# EAGLE design LACE_mod_con_auto (EAGLE 5.07)
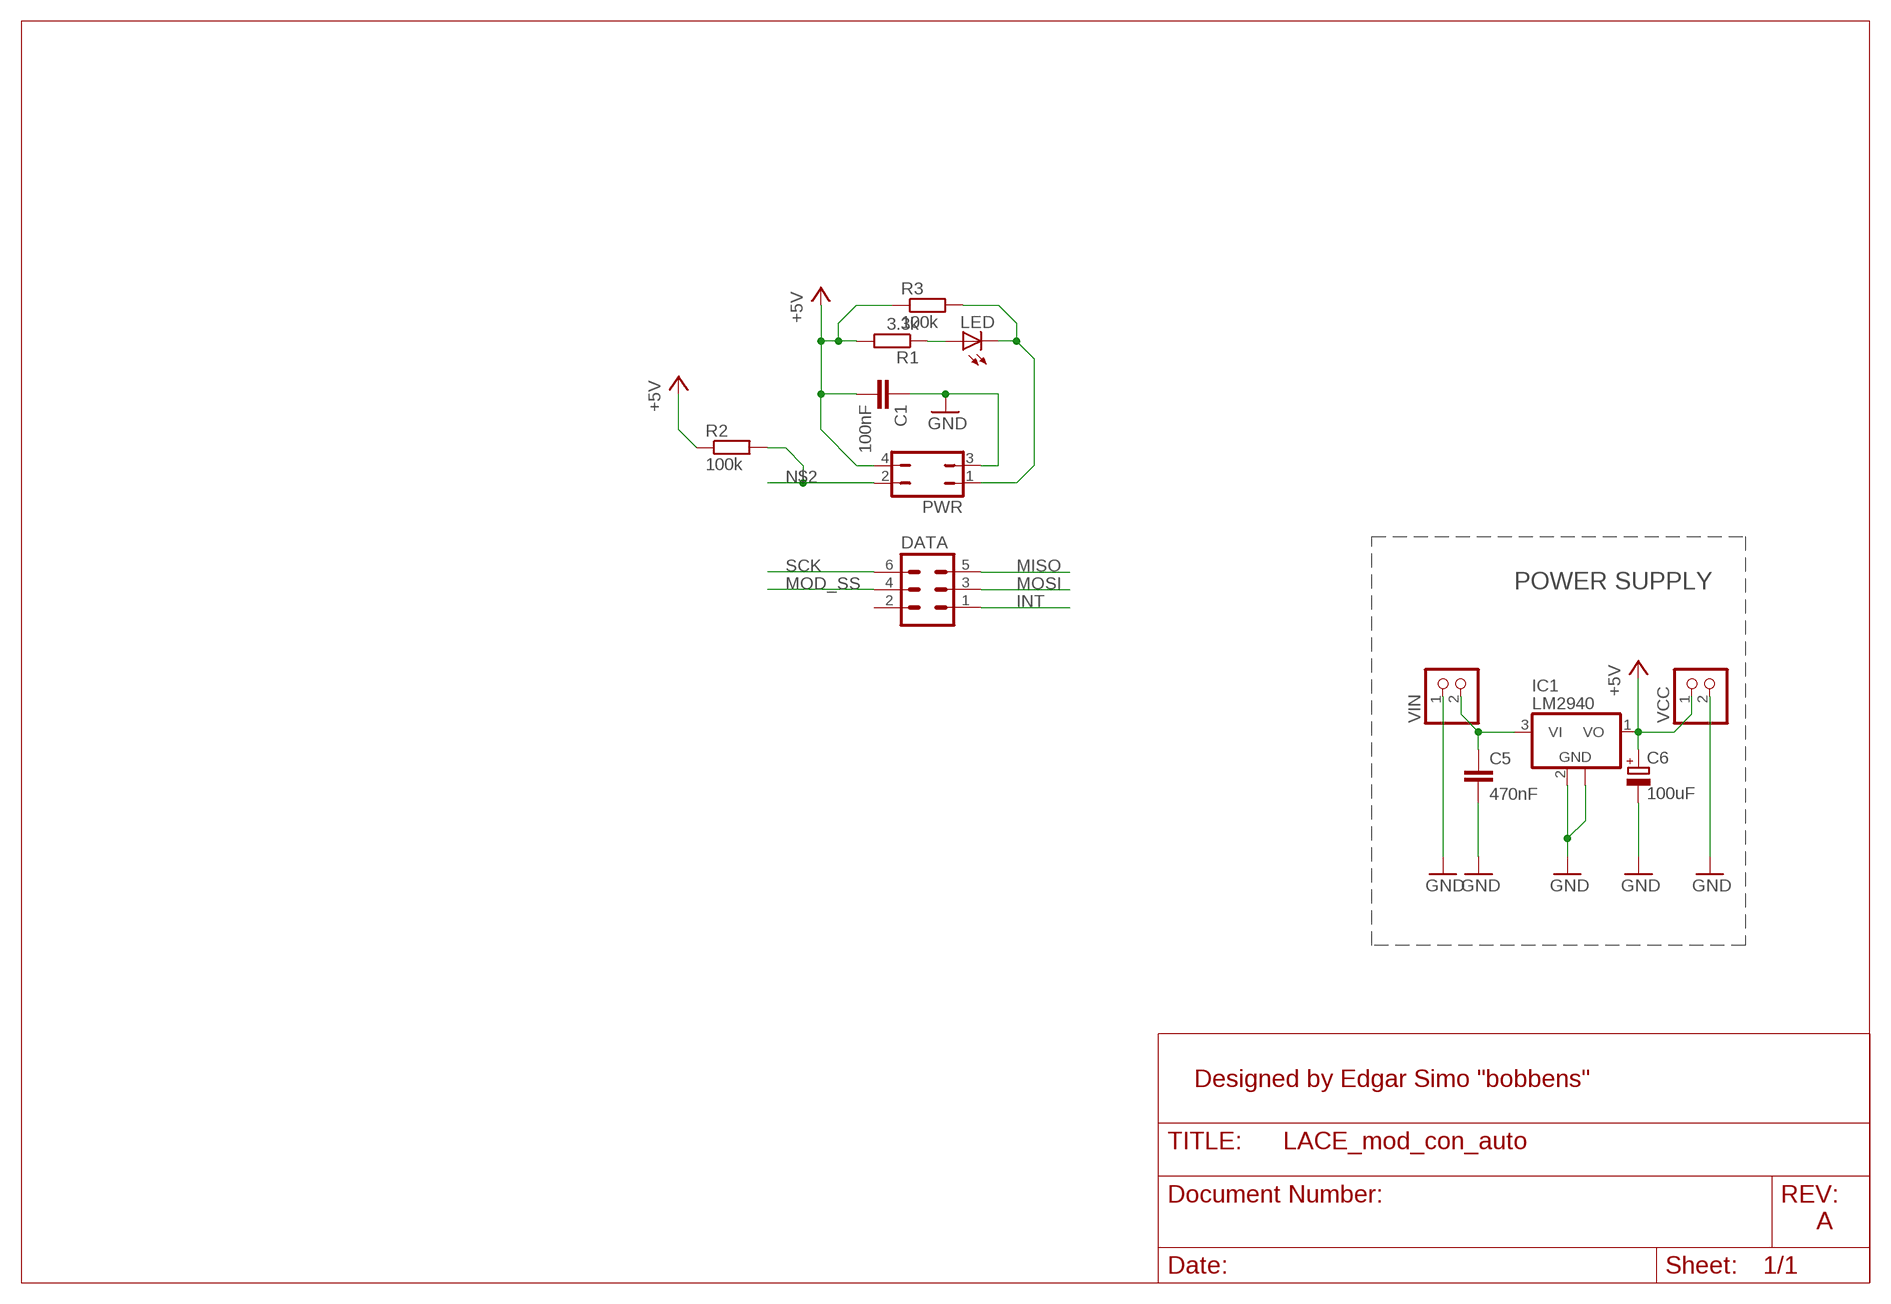
[diagram p0: schematic, sheet 1]

## Parts
C1  100nF  C-EUC0805K  [C0805K]
C5  470nF  C-EUC0805K  [C0805K]
C6  100uF  CPOL-EUE5-4  [E5-4]
DATA  MA03-2  [MA03-2]
IC1  LM2940  78L15F  [SOT89]
LED  LEDCHIPLED_0805  [CHIPLED_0805]
PWR  JP2Q  [JP2Q]
R1  3.3k  R-EU_M0805  [M0805]
R2  100k  R-EU_M0805  [M0805]
R3  100k  R-EU_M0805  [M0805]
VCC  PINHD-1X2  [1X02]
VIN  PINHD-1X2  [1X02]

## Nets
+5V: C1.2 C6.+ IC1.1(VO) PWR.4 R1.2 R2.1 R3.1 VCC.1
BAT+: C5.1 IC1.3(VI) VIN.2
GND: C1.1 C5.2 C6.- IC1.2(GND) IC1.2@1(GND) PWR.3 VCC.2 VIN.1
INT: DATA.1
MISO: DATA.5
MOD_SS: DATA.4
MOSI: DATA.3
N$1: LED.C PWR.1 R3.2
N$2: PWR.2 R2.2
R1: LED.A R1.1
SCK: DATA.6
Unconnected: DATA.2

## Notes on the sheet
- POWER SUPPLY
- Designed by Edgar Simo "bobbens"
- A

## Library data of the parts
C1 C5 = rcl:C-EU: CAPACITOR, European symbol
C6 = rcl:CPOL-EU: POLARIZED CAPACITOR, European symbol
DATA = con-lstb:MA03-2: PIN HEADER
IC1 = linear:78L*: POSITOIV-VOLTAGE REGULATORS Output up to 100 mA Source: http://focus.ti.com/lit/ds/symlink/ua78l05.pdf
LED = led:LED: LED OSRAM: - CHIPLED LG R971, LG N971, LY N971, LG Q971, LY Q971, LO R971, LY R971 LH N974, LH R974 LS Q976, LO Q976, LY Q976 LO Q996 - Hyper CHIPLED LW Q18S LB Q993, LB Q99A, LB R99A - SideLED LS A670, LO A670, LY A670, LG A670, LP A670 LB A673, LV A673, LT A673, LW A673 LH A674 LY A675 LS A676, LA A676, LO A676, LY A676, LW A676 LS A679, LY A679, LG A679 - Hyper Micro SIDELED® LS Y876, LA Y876, LO Y876, LY Y876 LT Y87S - SmartLED LW L88C, LW L88S LB L89C, LB L89S, LG L890 LS L89K, LO L89K, LY L89K LS L896, LA L896, LO L896, LY L896 - TOPLED LS T670, LO T670, LY T670, LG T670, LP T670 LSG T670, LSP T670, LSY T670, LOP T670, LYG T670 LG T671, LOG T671, LSG T671 LB T673, LV T673, LT T673, LW T673 LH T674 LS T676, LA T676, LO T676, LY T676, LB T676, LH T676, LSB T676, LW T676 LB T67C, LV T67C, LT T67C, LS T67K, LO T67K, LY T67K, LW E67C LS E67B, LA E67B, LO E67B, LY E67B, LB E67C, LV E67C, LT E67C LW T67C LS T679, LY T679, LG T679 LS T770, LO T770, LY T770, LG T770, LP T770 LB T773, LV T773, LT T773, LW T773 LH T774 LS E675, LA E675, LY E675, LS T675 LS T776, LA T776, LO T776, LY T776, LB T776 LHGB T686 LT T68C, LB T68C - Hyper Mini TOPLED® LB M676 - Mini TOPLED Santana® LG M470 LS M47K, LO M47K, LY M47K Source: http://www.osram.convergy.de LUXEON: - LUMILED® LXK2-PW12-R00, LXK2-PW12-S00, LXK2-PW14-U00, LXK2-PW14-V00 LXK2-PM12-R00, LXK2-PM12-S00, LXK2-PM14-U00 LXK2-PE12-Q00, LXK2-PE12-R00, LXK2-PE12-S00, LXK2-PE14-T00, LXK2-PE14-U00 LXK2-PB12-K00, LXK2-PB12-L00, LXK2-PB12-M00, LXK2-PB14-N00, LXK2-PB14-P00, LXK2-PB14-Q00 LXK2-PR12-L00, LXK2-PR12-M00, LXK2-PR14-Q00, LXK2-PR14-R00 LXK2-PD12-Q00, LXK2-PD12-R00, LXK2-PD12-S00 LXK2-PH12-R00, LXK2-PH12-S00 LXK2-PL12-P00, LXK2-PL12-Q00, LXK2-PL12-R00 Source: www.luxeon.com KINGBRIGHT: KA-3528ASYC Source: www.kingbright.com
PWR = jumper:JP2Q: JUMPER
R1-R3 = rcl:R-EU_: RESISTOR, European symbol
VCC VIN = pinhead:PINHD-1X2: PIN HEADER

## Board
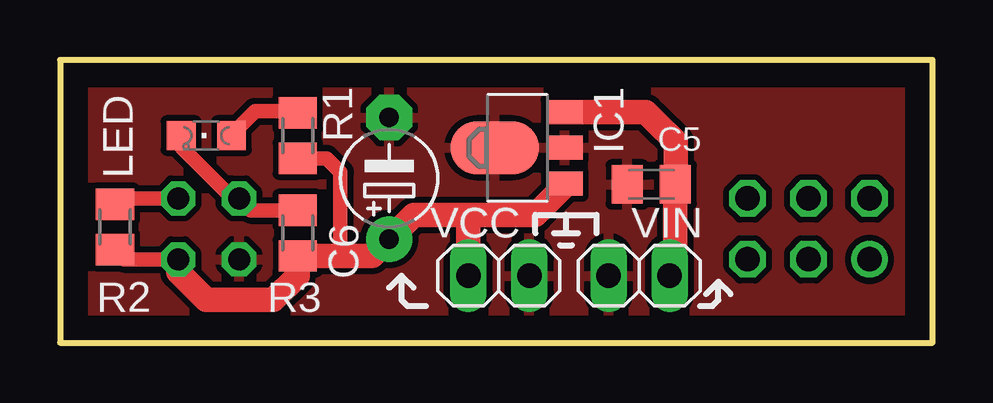
[diagram p1: board, top side]
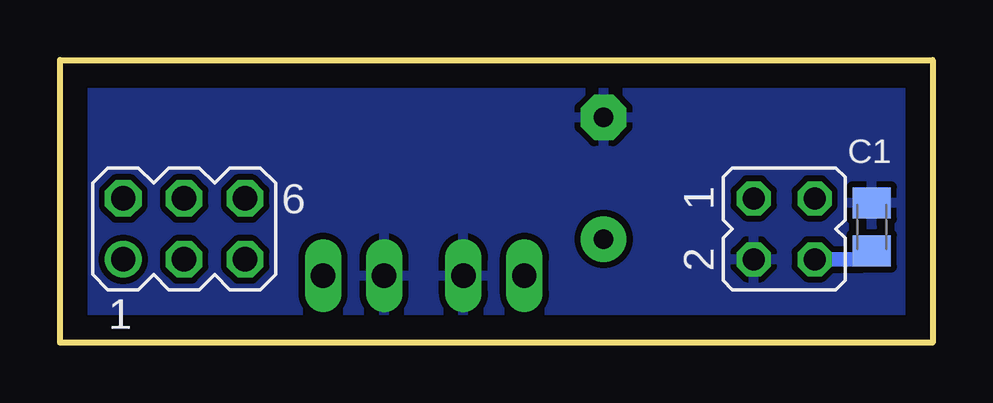
[diagram p2: board, bottom side, seen from below]

Size 36.36 x 11.79 mm. Coordinates in mm from the lower left corner, seen from the top.
Outline: 0,0 36.36,0 36.36,11.79 0,11.79 0,0
Copper layers (1*16): Top 0.035mm / dielectric 1.5mm / Bottom 0.035mm
Design rules "8mils": minimum track width 8mil, minimum drill 0.6mm, track to track 8mil, track to pad 8mil, pad to pad 8mil, via to via 8mil, smd to smd 8mil, copper to edge 40mil, drill to drill 10mil, minimum pad ring 10mil, minimum via ring 8mil, stop-mask expansion 0mil, vias tented up to drill 0mil, thermal gap 10mil

### Footprints (pad centres in the part's own frame; a part is rotated, then mirrored left to right if it is on the bottom)
C0805K = smd 1.3 x 1.6: 1 -1,0; 2 1,0
E5-4 = drill 0.813 pad 1.905 round: + -2.54,0 | drill 0.813 pad 1.905 octagon: - 2.54,0
MA03-2 = drill 1.016 round: 1 -2.54,-1.27 | drill 1.016 octagon: 2 -2.54,1.27; 3 0,-1.27; 4 0,1.27; 5 2.54,-1.27; 6 2.54,1.27
SOT89 = smd 1 x 1.5: 1 -1.499,-1.981; 2 0,-1.981; 3 1.499,-1.981 | smd 2.2 x 3.7: 2@1 0,0.94
CHIPLED_0805 = smd 1.2 x 1.2: A 0,-1.05; C 0,1.05
JP2Q = drill 0.914 octagon: 1 -1.27,-1.27; 2 -1.27,1.27; 3 1.27,-1.27; 4 1.27,1.27
M0805 = smd 1.3 x 1.6: 1 -0.95,0; 2 0.95,0
1X02 = drill 1.016 long: 1 -1.27,0; 2 1.27,0

### Placement (x,y rotation side)
C1  2.54,4.83 270 bottom
C5  24.64,6.6 180 top
C6  13.72,6.86 90 top
DATA  31.19,4.75 0 bottom
IC1  19.05,8.13 90 top
LED  6.1,8.64 90 top
PWR  6.19,4.75 270 bottom
R1  9.91,8.64 270 top
R2  2.29,4.83 90 top
R3  9.91,4.57 90 top
VCC  18.29,2.79 0 top
VIN  24.13,2.79 0 top

### Tracks (layer width: path | path; a pad name or v marks a point on that pad's centre or on a via)
+5V
  Top 0.61: PWR.4 2.69,3.48 R2.1 | R1.2 11.11,7.69 11.68,7.11 11.68,3.88 11.43,3.62
  Top 1.016: PWR.4 4.92,2.95 6.1,1.78 8.89,1.78 9.91,2.79 R3.1 11.43,3.62 13.02,3.62 C6.+ | C6.+ 14.02,4.62 | IC1.1 21.03,6.55 19.81,5.33 16.76,5.33 | 16.76,5.33 14.73,5.33 C6.+ | VCC.1 17.02,5.08 16.76,5.33
  Bottom 0.406: 2.89,3.48 C1.2
  Bottom 0.61: PWR.4 2.89,3.48
BAT+
  Top 1.016: VIN.2 25.64,3.03 C5.1 25.65,6.62 25.65,8.38 24.77,9.27 24.64,9.4 24.41,9.63 IC1.3
GND
  pour Bottom (isolate 0.254): -0.51,-0.25 -0.51,12.45 36.58,12.45 36.58,-0.51
  pour Top (isolate 0.254): 0.25,0.51 0.25,11.43 36.07,11.43 36.07,0.25
N$1
  Top 0.61: LED.C 5.08,8.6 5.08,8.13 7.19,6.02 PWR.1 7.95,5.52 R3.2
N$2
  Top 0.61: PWR.2 2.53,6.02 R2.2
R1
  Top 0.61: LED.A 7.15,8.67 8.13,9.65 9.84,9.65 R1.1